# EAGLE design fab_scope (EAGLE 7.7.0)
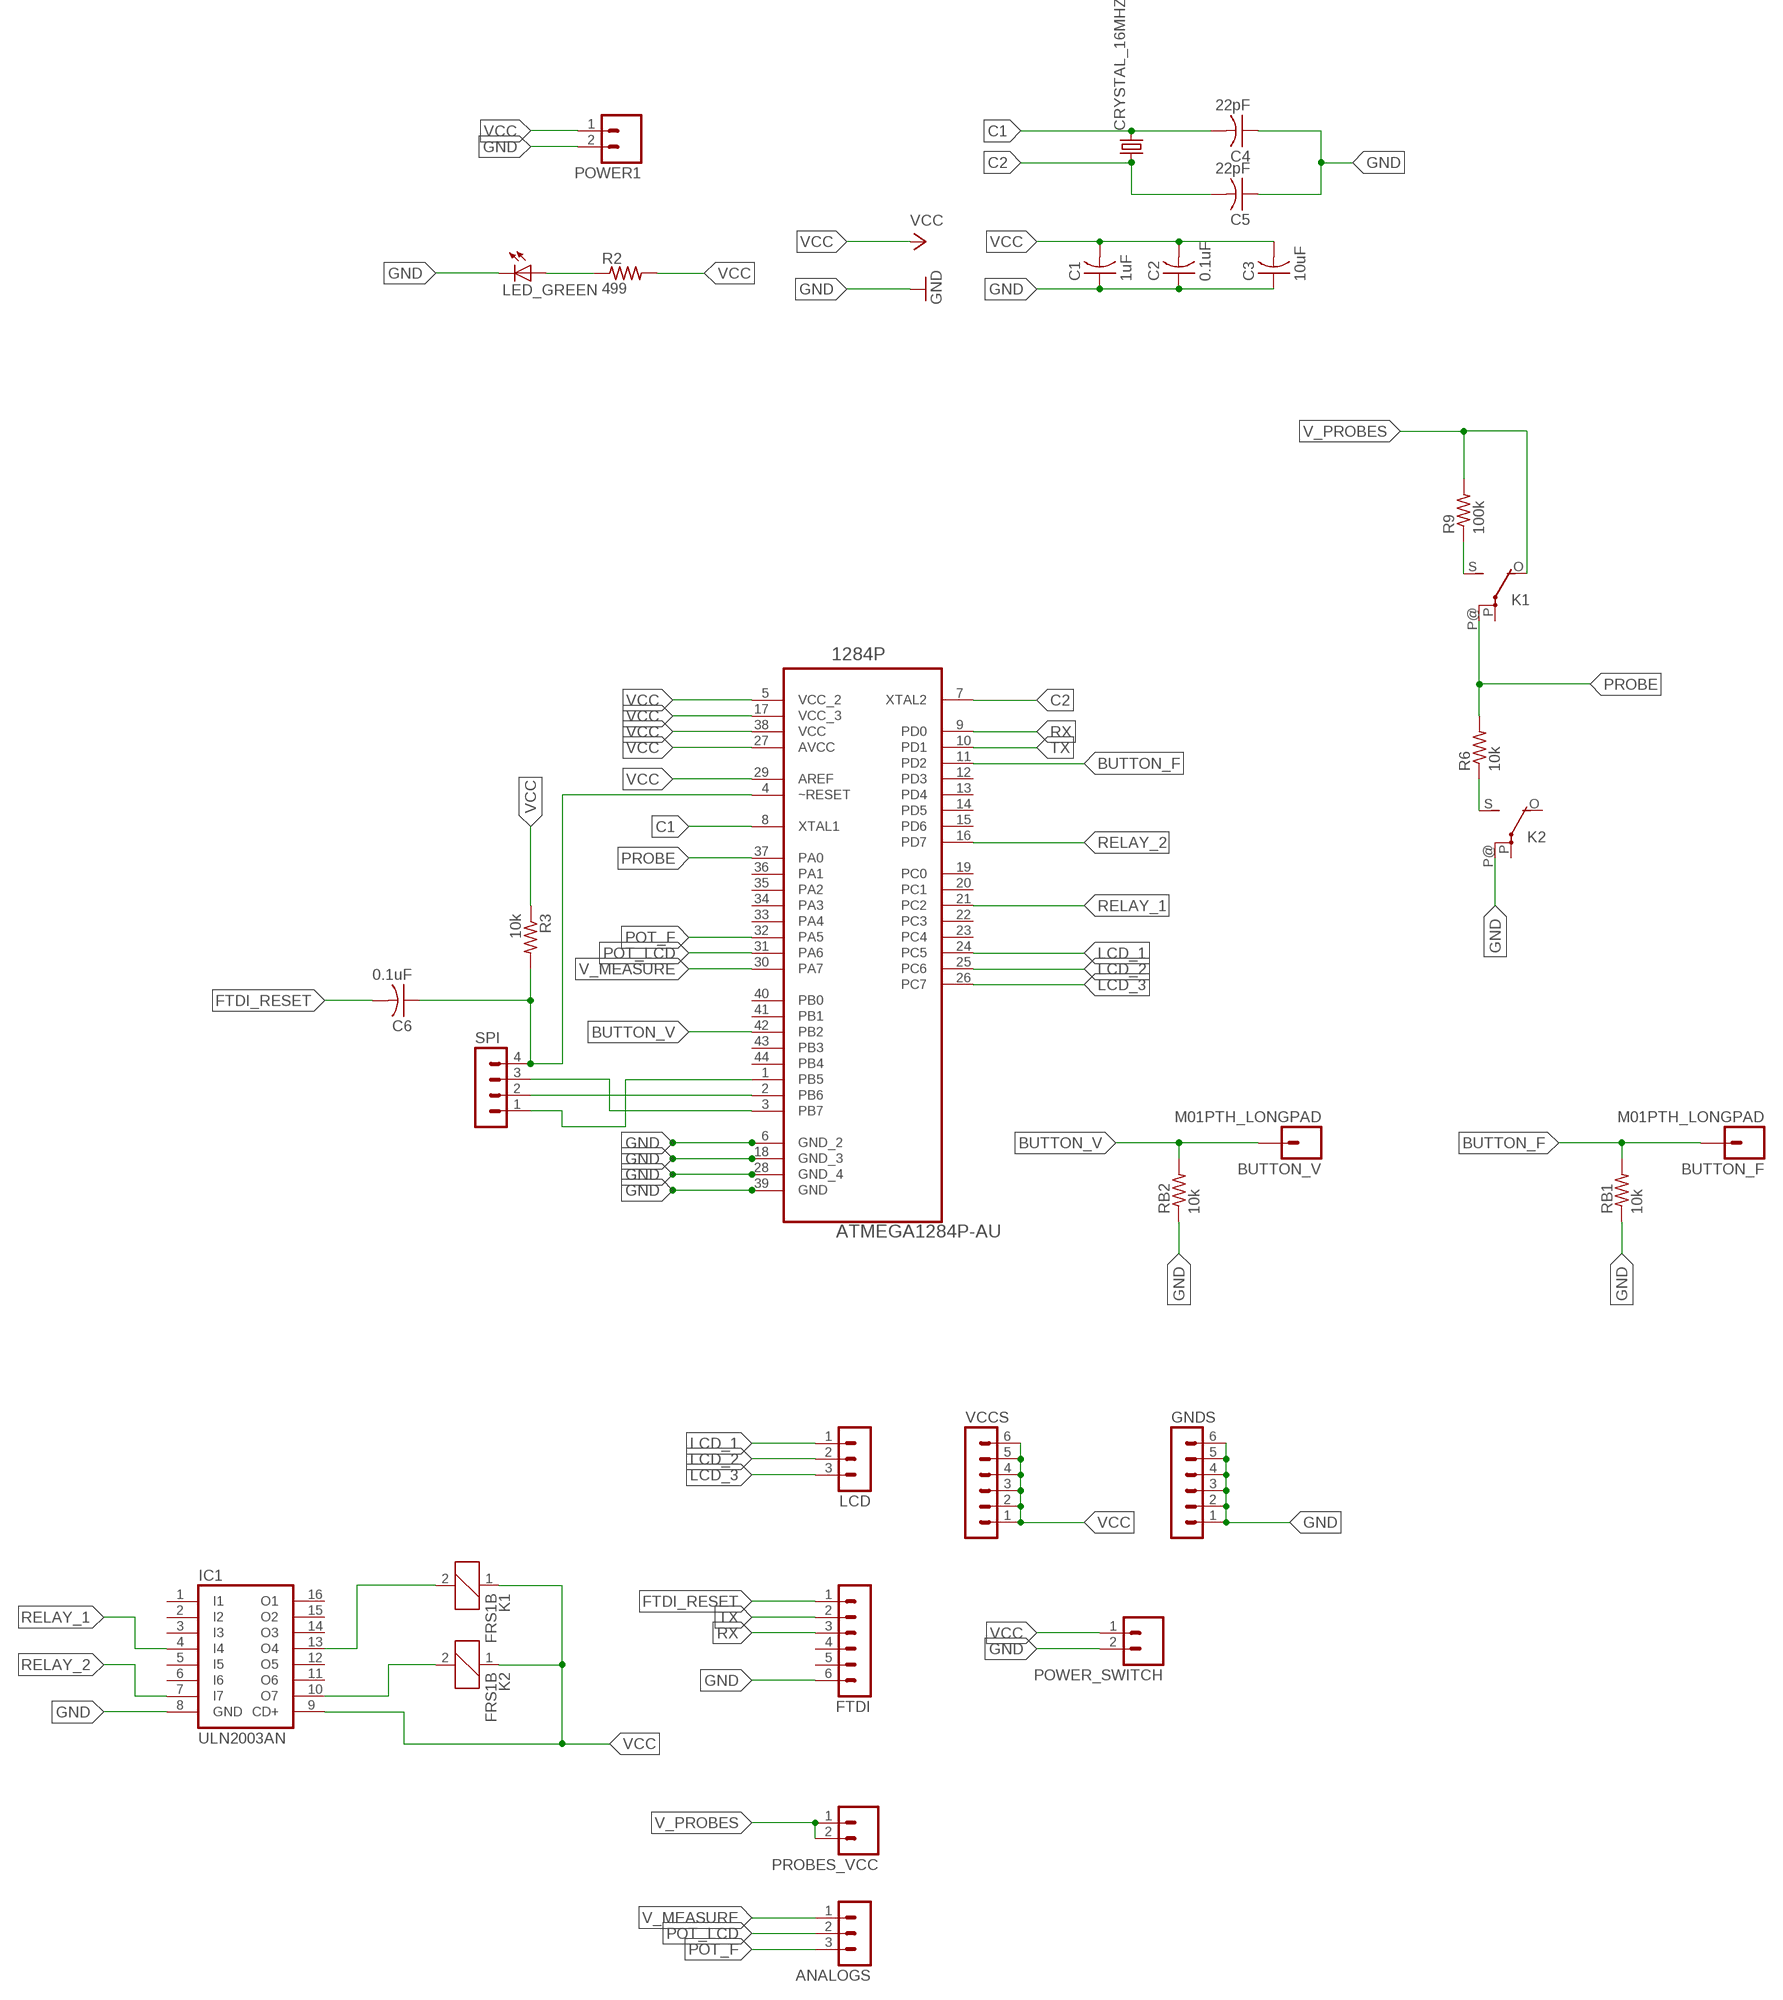
[diagram p0: schematic, sheet 1]

## Parts
1284P  ATMEGA1284P-AU  [QFP80P1200X1200X120-44N]
ANALOGS  MA03-1  [MA03-1]
BUTTON_F  M01PTH_LONGPAD  [1X01_LONGPAD]
BUTTON_V  M01PTH_LONGPAD  [1X01_LONGPAD]
C1  1uF  CAP-US1206  [C1206]
C2  0.1uF  CAP-US1206  [C1206]
C3  10uF  CAP-US1206  [C1206]
C4  22pF  CAP-US1206  [C1206]
C5  22pF  CAP-US1206  [C1206]
C6  0.1uF  CAP-US1206  [C1206]
CRYSTAL_16MHZ  CRYSTALHC49UP  [HC49UP]
FTDI  MA06-1  [MA06-1]
GNDS  MA06-1  [MA06-1]
IC1  ULN2003AN  [DIL16]
K1  FRS1B  [FRS1B]
K2  FRS1B  [FRS1B]
LCD  MA03-1  [MA03-1]
LED_GREEN  LED1206  [1206]
POWER1  M02  [02P]
POWER_SWITCH  M02  [02P]
PROBES_VCC  M02  [02P]
R2  499  RES-US1206  [R1206]
R3  10k  RES-US1206  [R1206]
R6  10k  RES-US1206  [R1206]
R9  100k  RES-US1206  [R1206]
RB1  10k  RES-US1206  [R1206]
RB2  10k  RES-US1206  [R1206]
SPI  MA04-1  [MA04-1]
VCCS  MA06-1  [MA06-1]

## Nets
BUTTON_F: 1284P.11(PD2) BUTTON_F.1 RB1.2
BUTTON_V: 1284P.42(PB2) BUTTON_V.1 RB2.2
C1: 1284P.8(XTAL1) C4.2 CRYSTAL_16MHZ.2
C2: 1284P.7(XTAL2) C5.2 CRYSTAL_16MHZ.1
FTDI_RESET: C6.2 FTDI.1
GND: 1284P.6(GND_2) C1.1 C2.1 C3.1 C4.1 C5.1 FTDI.6 GNDS.1 GNDS.2 GNDS.3 GNDS.4 GNDS.5 GNDS.6 IC1.8(GND) K2.P@(2:P) LED_GREEN.2(C) POWER1.2 POWER_SWITCH.2 RB1.1 RB2.1
LCD_1: 1284P.24(PC5) LCD.1
LCD_2: 1284P.25(PC6) LCD.2
LCD_3: 1284P.26(PC7) LCD.3
N$1: 1284P.18(GND_3)
N$2: 1284P.28(GND_4)
N$3: 1284P.39(GND)
N$4: IC1.10(O7) K2.2
N$5: IC1.13(O4) K1.2
N$6: 1284P.38(VCC)
N$11: K2.S(2:S) R6.1
N$14: K1.S(2:S) R9.1
N$21: 1284P.3(PB7) SPI.3
N$22: 1284P.2(PB6) SPI.2
N$23: 1284P.1(PB5) SPI.1
N$24: 1284P.4(~RESET) C6.1 R3.2 SPI.4
N$26: LED_GREEN.1(A) R2.1
POT_F: 1284P.32(PA5) ANALOGS.3
POT_LCD: 1284P.31(PA6) ANALOGS.2
PROBE: 1284P.37(PA0) K1.P@(2:P) R6.2
RELAY_1: 1284P.21(PC2) IC1.4(I4)
RELAY_2: 1284P.16(PD7) IC1.7(I7)
RX: 1284P.9(PD0) FTDI.3
TX: 1284P.10(PD1) FTDI.2
V_MEASURE: 1284P.30(PA7) ANALOGS.1
V_PROBES: K1.O(2:O) PROBES_VCC.1 PROBES_VCC.2 R9.2
VCC: 1284P.5(VCC_2) 1284P.17(VCC_3) 1284P.27(AVCC) 1284P.29(AREF) C1.2 C2.2 C3.2 IC1.9(CD+) K1.1 K2.1 POWER1.1 POWER_SWITCH.1 R2.2 R3.1 VCCS.1 VCCS.2 VCCS.3 VCCS.4 VCCS.5 VCCS.6
Unconnected: 1284P.12(PD3) 1284P.13(PD4) 1284P.14(PD5) 1284P.15(PD6) 1284P.19(PC0) 1284P.20(PC1) 1284P.22(PC3) 1284P.23(PC4) 1284P.33(PA4) 1284P.34(PA3) 1284P.35(PA2) 1284P.36(PA1) 1284P.40(PB0) 1284P.41(PB1) 1284P.43(PB3) 1284P.44(PB4) FTDI.4 FTDI.5 IC1.1(I1) IC1.2(I2) IC1.3(I3) IC1.5(I5) IC1.6(I6) IC1.11(O6) IC1.12(O5) IC1.14(O3) IC1.15(O2) IC1.16(O1) K1.P(2:P) K2.O(2:O) K2.P(2:P)

## Library data of the parts
1284P = 1284:ATMEGA1284P-AU: Microcontroller with Programmable Flash; MPN: ATMEGA1284P-AU; OC_FARNELL: 1715480; OC_NEWARK: 15R0263; PACKAGE: TQFP-44; SUPPLIER: Atmel
ANALOGS LCD = con-lstb:MA03-1: PIN HEADER; OC_FARNELL: unknown; OC_NEWARK: unknown
BUTTON_F BUTTON_V = 01_SparkFun:M01: Header 1 Standard 1-pin 0.1" header. Use with straight break away headers (SKU : PRT-00116), right angle break away headers (PRT-00553), swiss pins (PRT-00743), machine pins (PRT-00117), and female headers (PRT-00115).
C1-C6 = fab:CAP-US
CRYSTAL_16MHZ = crystal:CRYSTAL: CRYSTAL; OC_FARNELL: unknown; OC_NEWARK: unknown
FTDI GNDS VCCS = con-lstb:MA06-1: PIN HEADER; OC_FARNELL: unknown; OC_NEWARK: unknown
IC1 = uln-udn:ULN2003A: DRIVER ARRAY
K1 K2 = relay:FRS1B: RELAY 1 x switch, same as V23101-D6-A201, Siemens
LED_GREEN = FAB_Hello:LED
POWER1 POWER_SWITCH PROBES_VCC = con-amp-quick:M02: AMP QUICK CONNECTOR; OC_FARNELL: unknown; OC_NEWARK: unknown
R2 R3 R6 R9 RB1 RB2 = fab:RES-US: Resistor (US Symbol) Variants with postfix FAB are widened to allow the routing of internal traces
SPI = con-lstb:MA04-1: PIN HEADER; OC_FARNELL: unknown; OC_NEWARK: unknown

## Board
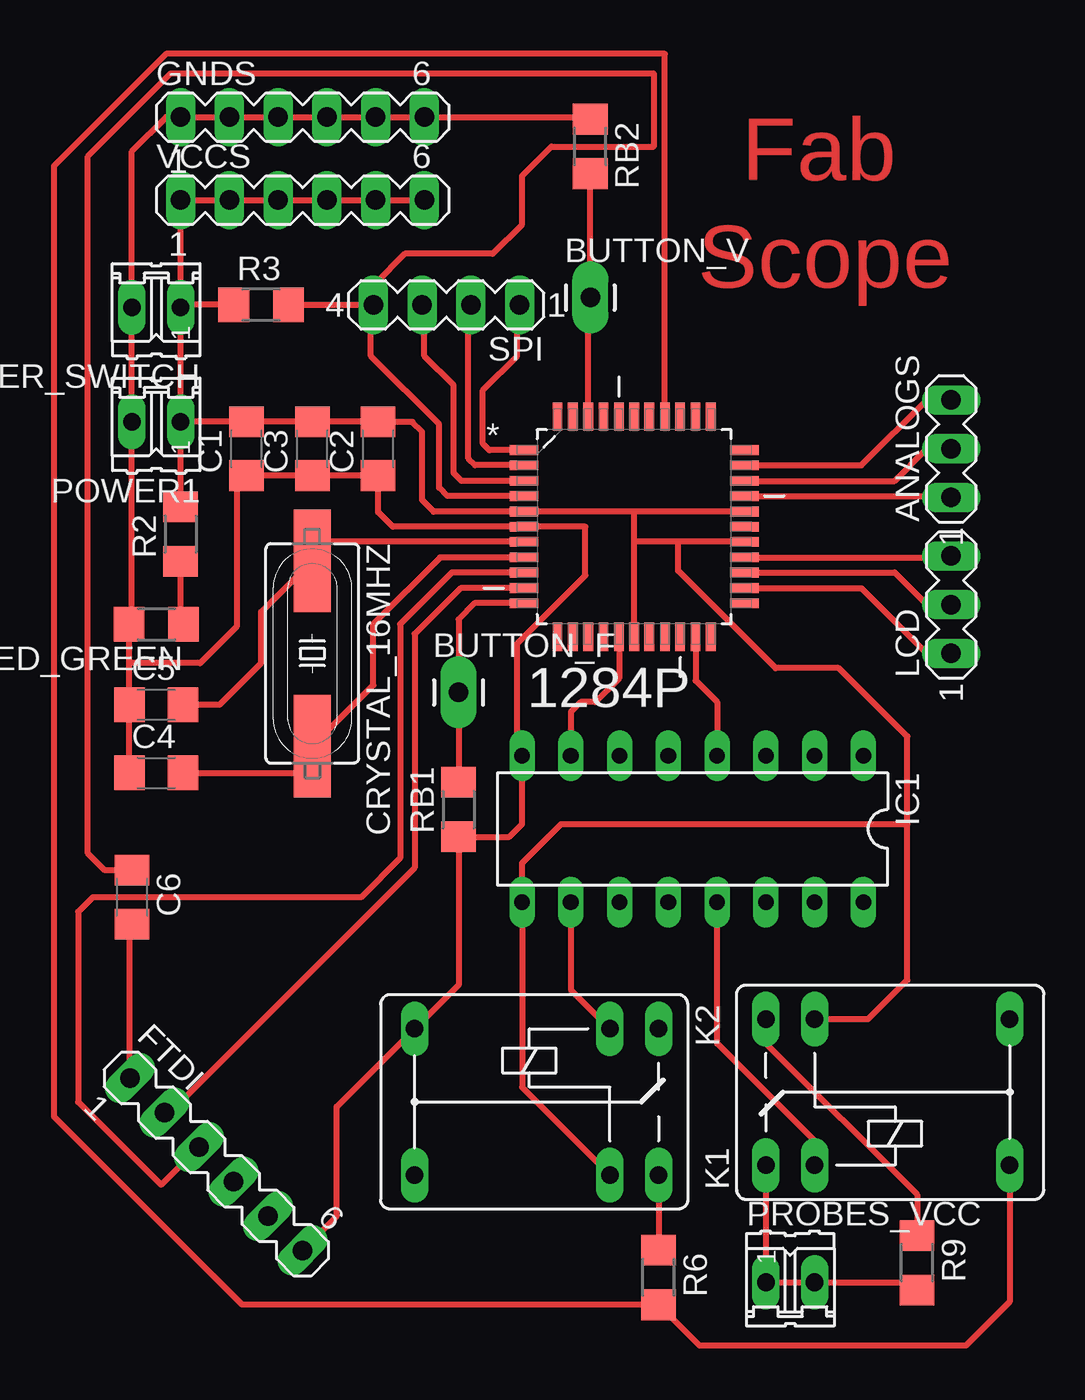
[diagram p1: board, top side]

No outline drawn. Coordinates in mm, seen from the top.
Copper layers (1*16): Top 0.035mm / dielectric 1.5mm / Bottom 0.035mm
Design rules "default": minimum track width 10mil, minimum drill 24mil, track to track 8mil, track to pad 8mil, pad to pad 8mil, via to via 8mil, smd to smd 8mil, copper to edge 40mil, drill to drill 8mil, minimum pad ring 10mil, minimum via ring 8mil, stop-mask expansion 4mil, vias tented up to drill 0mil, thermal gap 10mil

### Footprints (pad centres in the part's own frame; a part is rotated, then mirrored left to right if it is on the bottom)
QFP80P1200X1200X120-44N = smd 1.473 x 0.508: 1 -5.74,3.988; 2 -5.74,3.2; 3 -5.74,2.388; 4 -5.74,1.6; 5 -5.74,0.787; 6 -5.74,0; 7 -5.74,-0.787; 8 -5.74,-1.6; 9 -5.74,-2.388; 10 -5.74,-3.2; 11 -5.74,-3.988; 23 5.74,-3.988; 24 5.74,-3.2; 25 5.74,-2.388; 26 5.74,-1.6; 27 5.74,-0.787; 28 5.74,0; 29 5.74,0.787; 30 5.74,1.6; 31 5.74,2.388; 32 5.74,3.2; 33 5.74,3.988 | smd 0.508 x 1.473: 12 -3.988,-5.74; 13 -3.2,-5.74; 14 -2.388,-5.74; 15 -1.6,-5.74; 16 -0.787,-5.74; 17 0,-5.74; 18 0.787,-5.74; 19 1.6,-5.74; 20 2.388,-5.74; 21 3.2,-5.74; 22 3.988,-5.74; 34 3.988,5.74; 35 3.2,5.74; 36 2.388,5.74; 37 1.6,5.74; 38 0.787,5.74; 39 0,5.74; 40 -0.787,5.74; 41 -1.6,5.74; 42 -2.388,5.74; 43 -3.2,5.74; 44 -3.988,5.74
MA03-1 = drill 1.016 long: 1 -2.54,0; 2 0,0; 3 2.54,0
1X01_LONGPAD = drill 1.016 pad 1.88 long: 1 0,0
C1206 = smd 1.6 x 1.8: 1 -1.4,0; 2 1.4,0
HC49UP = smd 5.334 x 1.93: 1 -4.826,0; 2 4.826,0
MA06-1 = drill 1.016 long: 1 -6.35,0; 2 -3.81,0; 3 -1.27,0; 4 1.27,0; 5 3.81,0; 6 6.35,0
DIL16 = drill 0.813 long: 1 -8.89,-3.81; 2 -6.35,-3.81; 3 -3.81,-3.81; 4 -1.27,-3.81; 5 1.27,-3.81; 6 3.81,-3.81; 7 6.35,-3.81; 8 8.89,-3.81; 9 8.89,3.81; 10 6.35,3.81; 11 3.81,3.81; 12 1.27,3.81; 13 -1.27,3.81; 14 -3.81,3.81; 15 -6.35,3.81; 16 -8.89,3.81
FRS1B = drill 0.914 long: 1 0,3.81; 2 0,-3.81; O -2.54,-3.81; P 10.16,3.81; P@ 10.16,-3.81; S -2.54,3.81
1206 = smd 1.6 x 1.803: 1 -1.422,0; 2 1.422,0
02P = drill 0.914 long: 1 -1.27,0; 2 1.27,0
R1206 = smd 1.6 x 1.803: 1 -1.422,0; 2 1.422,0
MA04-1 = drill 1.016 long: 1 -3.81,0; 2 -1.27,0; 3 1.27,0; 4 3.81,0

### Placement (x,y rotation side)
1284P  32,49.02 0 top
ANALOGS  48.51,53.09 90 top
BUTTON_F  22.86,40.39 0 top
BUTTON_V  29.72,60.96 0 top
C1  11.81,53.09 90 top
C2  18.67,53.09 90 top
C3  15.24,53.09 90 top
C4  7.11,36.2 0 top
C5  7.11,39.75 0 top
C6  5.84,29.72 270 top
CRYSTAL_16MHZ  15.24,42.42 270 top
FTDI  10.23,15.8 315 top
GNDS  14.73,70.36 0 top
IC1  35.05,33.27 180 top
K1  41.4,19.56 0 top
K2  30.73,19.05 180 top
LCD  48.51,44.96 90 top
LED_GREEN  7.11,43.94 180 top
POWER1  7.11,54.48 180 top
POWER_SWITCH  7.11,60.45 180 top
PROBES_VCC  40.13,9.65 0 top
R2  8.38,48.64 90 top
R3  12.57,60.58 0 top
R6  33.27,9.91 270 top
R9  46.74,10.67 270 top
RB1  22.86,34.29 90 top
RB2  29.72,68.83 270 top
SPI  22.23,60.58 180 top
VCCS  14.73,66.04 0 top

### Tracks (layer width: path | path; a pad name or v marks a point on that pad's centre or on a via)
BUTTON_F
  Top 0.305: 1284P.11 23.7,45.03 22.86,44.2 BUTTON_F.1 RB1.2
BUTTON_V
  Top 0.305: 1284P.42 29.62,60.86 BUTTON_V.1 RB2.2
C1
  Top 0.305: C4.2 15.24,36.2 CRYSTAL_16MHZ.2 18.41,40.77 18.41,43.94 21.89,47.42 1284P.8
C2
  Top 0.305: C5.2 10.41,39.75 12.57,41.91 12.57,44.58 CRYSTAL_16MHZ.1 15.24,48.23 1284P.7
FTDI_RESET
  Top 0.305: FTDI.1 5.74,28.32 C6.2
GND
  Top 0.305: 5.69,36.17 C4.1 C5.1 5.71,41.91 | LED_GREEN.2 5.69,43.2 5.71,43.18 | 5.71,43.28 LED_GREEN.2 | LED_GREEN.2 5.84,43.46 POWER1.2 POWER_SWITCH.2 5.84,68.58 7.62,70.36 GNDS.1 GNDS.2 GNDS.3 GNDS.4 GNDS.5 GNDS.6 29.62,70.36 RB2.1 | 5.84,44.09 LED_GREEN.2 | 5.71,41.91 5.71,43.92 LED_GREEN.2 | 5.71,41.91 9.4,41.91 11.3,43.81 11.3,51.69 C1.1 C3.1 C2.1 18.67,49.78 19.43,49.02 1284P.6 29.46,49.02 29.46,46.48 25.91,42.93 25.91,37.34 IC1.8 26.16,33.53 25.5,32.87 RB1.1 22.86,25.15 K2.P@ 16.51,18.8 16.51,13.1 FTDI.6
LCD_1
  Top 0.305: 1284P.24 43.84,45.82 47.24,42.42 LCD.1
LCD_2
  Top 0.305: 1284P.25 45.57,46.63 47.24,44.96 LCD.2
LCD_3
  Top 0.305: 1284P.26 48.44,47.42 LCD.3
N$4
  Top 0.305: IC1.10 28.7,24.89 K2.2
N$5
  Top 0.305: K1.2 41.4,17.02 36.32,22.1 IC1.13
N$11
  Top 0.305: K2.S R6.1
N$14
  Top 0.305: K1.S 38.86,22.1 46.74,14.22 R9.1
N$21
  Top 0.305: 1284P.3 23.01,51.41 22.61,51.82 22.61,56.39 21.08,57.91 21.08,60.45 SPI.3
N$22
  Top 0.305: 1284P.2 23.72,52.22 23.37,52.58 23.37,60.45 SPI.2
N$23
  Top 0.305: 1284P.1 24.46,53.01 24.13,53.34 24.13,56.13 25.91,57.91 25.91,60.45 SPI.1
N$24
  Top 0.305: R3.2 SPI.4 | 1284P.4 22.28,50.62 21.84,51.05 21.84,54.36 18.29,57.91 18.29,60.45 SPI.4 | SPI.4 18.54,60.71 18.54,61.72 20.07,63.25 24.64,63.25 26.16,64.77 26.16,67.31 27.69,68.83 33.02,68.83 33.02,72.64 7.87,72.64 3.56,68.33 3.56,32 4.44,31.12 C6.1
N$26
  Top 0.305: LED_GREEN.1 8.38,44.09 R2.1
POT_F
  Top 0.305: 1284P.32 43.84,52.22 47.24,55.63 ANALOGS.3
POT_LCD
  Top 0.305: 1284P.31 45.57,51.41 47.24,53.09 ANALOGS.2
PROBE
  Top 0.305: 1284P.37 33.6,73.66 7.62,73.66 1.78,67.82 1.78,18.29 11.58,8.48 R6.2 35.41,6.35 49.28,6.35 51.56,8.64 K1.P@
RELAY_1
  Top 0.305: 1284P.21 35.2,41 36.32,39.88 IC1.4
RELAY_2
  Top 0.305: 1284P.16 31.22,41.12 29.97,39.88 29.21,39.88 28.7,39.37 IC1.7
RX
  Top 0.305: 1284P.9 22.5,46.63 19.81,43.94 19.81,31.75 17.78,29.72 3.81,29.72 3.05,28.96 3.05,19.05 7.37,14.73 FTDI.3
TX
  Top 0.305: 1284P.10 22.96,45.82 20.57,43.43 20.57,31.24 8.13,18.8 7.84,18.8 FTDI.2
V_MEASURE
  Top 0.305: 1284P.30 48.44,50.62 ANALOGS.1
V_PROBES
  Top 0.305: K1.O PROBES_VCC.1 PROBES_VCC.2 46.33,9.65 R9.2
VCC
  Top 0.305: POWER_SWITCH.1 R2.2 POWER1.1 C1.2 C3.2 C2.2 20.45,54.48 20.95,53.98 20.95,50.42 21.57,49.81 1284P.5 32,49.81 | POWER_SWITCH.1 VCCS.1 VCCS.2 | VCCS.2 VCCS.3 VCCS.4 VCCS.5 VCCS.6 | 11.15,65.81 VCCS.2 | R3.1 8.51,60.58 POWER_SWITCH.1 | 1284P.29 32,49.81 | 1284P.17 32,48.26 | 32,48.26 32,49.81 | 1284P.27 37.74,48.26 34.29,48.26 | 34.29,48.26 32,48.26 | 46.23,33.53 28.19,33.53 26.16,31.5 IC1.9 26.16,19.81 K2.1 | 46.23,33.53 46.23,38.1 42.67,41.66 39.37,41.66 34.29,46.74 34.29,48.26 | K1.1 44.2,23.37 46.23,25.4 46.23,33.53

### Text on the board
Top: Fab | Scope